# EAGLE schematic Linefollower_STM32 (EAGLE 9.6.2)
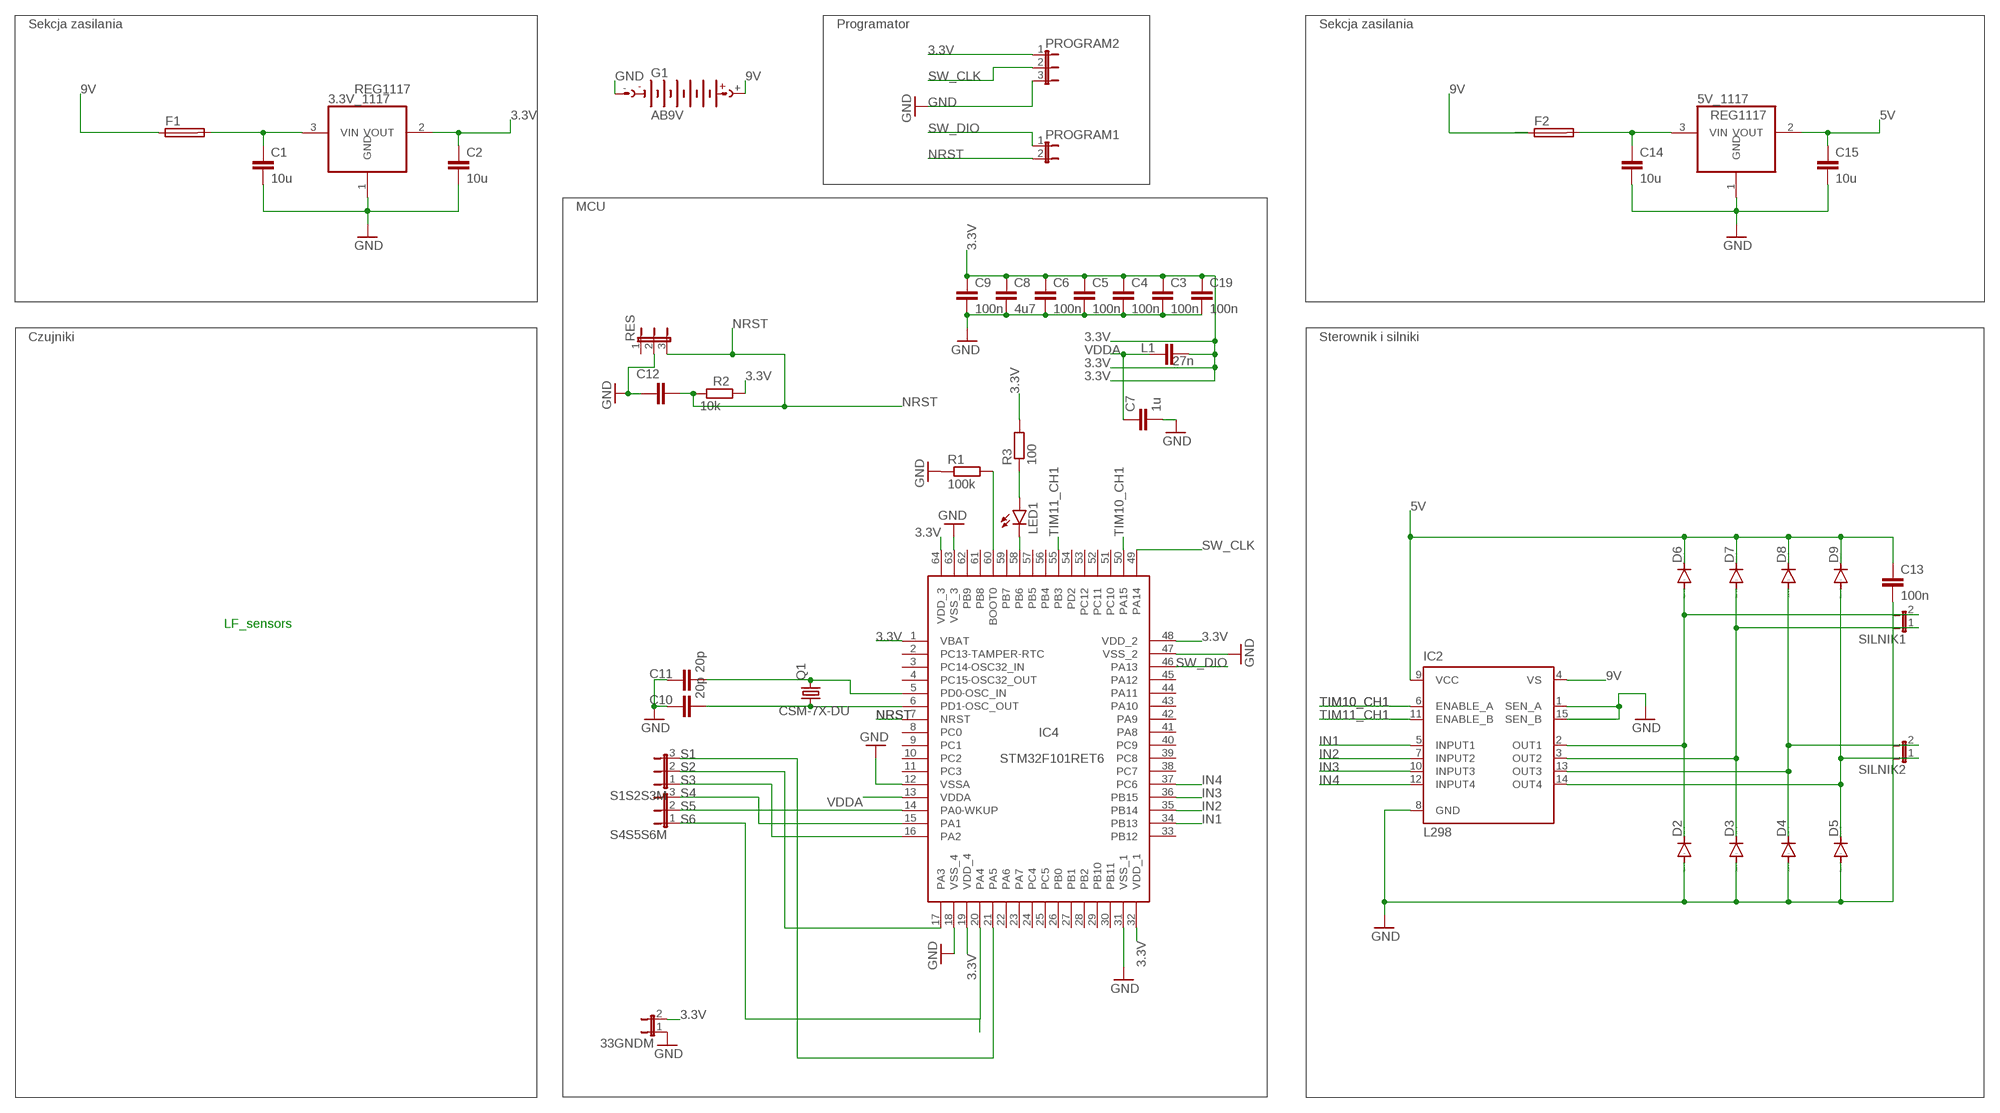
[diagram p0: schematic, sheet 1]

## Parts
3.3V_1117  REG1117  [SOT223]
5V_1117  REG1117  [SOT223]
33GNDM  JP1E  [JP1]
C1  10u  C-EUC0805  [C0805]
C2  10u  C-EUC0805  [C0805]
C3  100n  C-EUC0805  [C0805]
C4  100n  C-EUC0805  [C0805]
C5  100n  C-EUC0805  [C0805]
C6  100n  C-EUC0805  [C0805]
C7  1u  C-EUC0805  [C0805]
C8  4u7  C-EUC0805  [C0805]
C9  100n  C-EUC0805  [C0805]
C10  20p  C-EUC0805  [C0805]
C11  20p  C-EUC0805  [C0805]
C12  C-EUC0805  [C0805]
C13  100n  C-EUC0805  [C0805]
C14  10u  C-EUC0805  [C0805]
C15  10u  C-EUC0805  [C0805]
C19  100n  C-EUC0805  [C0805]
D2  DIODE-DO214AA  [DO214AA]
D3  DIODE-DO214AA  [DO214AA]
D4  DIODE-DO214AA  [DO214AA]
D5  DIODE-DO214AA  [DO214AA]
D6  DIODE-DO214AA  [DO214AA]
D7  DIODE-DO214AA  [DO214AA]
D8  DIODE-DO214AA  [DO214AA]
D9  DIODE-DO214AA  [DO214AA]
F1  TE5  [TE5]
F2  TE5  [TE5]
G1  AB9V  [AB9V]
IC2  L298  [MULTIWATT-15]
IC4  STM32F101RET6  [QFP50P1200X1200X160-64N]
L1  27n  C-EUC0805  [C0805]
LED1  LEDSML1206  [SML1206]
PROGRAM1  JP1E  [JP1]
PROGRAM2  JP2E  [JP2]
Q1  CSM-7X-DU  [CSM-7X-DU]
R1  100k  R-EU_R0805  [R0805]
R2  10k  R-EU_R0805  [R0805]
R3  100  R-EU_R0805  [R0805]
RES  JP2E  [JP2]
S1S2S3M  JP2E  [JP2]
S4S5S6M  JP2E  [JP2]
SILNIK1  JP1E  [JP1]
SILNIK2  JP1E  [JP1]

## Nets
3.3V: 3.3V_1117.2(VOUT) 33GNDM.2 C2.1 C3.1 C4.1 C5.1 C6.1 C8.1 C9.1 C19.1 IC4.1(VBAT) IC4.19(VDD_4) IC4.32(VDD_1) IC4.48(VDD_2) IC4.64(VDD_3) L1.2 PROGRAM2.1 R2.2 R3.2
5V: 5V_1117.2(VOUT) C13.1 C15.1 D6.C D7.C D8.C D9.C IC2.9(VCC)
9V: F1.1 F2.1 G1.+ IC2.4(VS)
GND: 3.3V_1117.1(GND) 5V_1117.1(GND) 33GNDM.1 C1.2 C2.2 C3.2 C4.2 C5.2 C6.2 C7.2 C8.2 C9.2 C10.1 C11.1 C12.1 C13.2 C14.2 C15.2 C19.2 D2.A D3.A D4.A D5.A G1.- IC2.1(SEN_A) IC2.8(GND) IC2.15(SEN_B) IC4.12(VSSA) IC4.18(VSS_4) IC4.31(VSS_1) IC4.47(VSS_2) IC4.63(VSS_3) PROGRAM2.3 R1.1 RES.2
IN1: IC2.5(INPUT1) IC4.34(PB13)
IN2: IC2.7(INPUT2) IC4.35(PB14)
IN3: IC2.10(INPUT3) IC4.36(PB15)
IN4: IC2.12(INPUT4) IC4.37(PC6)
N$1: C10.2 IC4.6(PD1-OSC_OUT) Q1.1
N$3: 3.3V_1117.3(VIN) C1.1 F1.2
N$4: C11.2 IC4.5(PD0-OSC_IN) Q1.2
N$5: IC4.60(BOOT0) R1.2
N$6: IC4.58(PB6) LED1.C
N$7: LED1.A R3.1
N$17: D2.C D6.A IC2.2(OUT1) SILNIK1.2
N$18: D3.C D7.A IC2.3(OUT2) SILNIK1.1
N$19: D4.C D8.A IC2.13(OUT3) SILNIK2.2
N$20: D5.C D9.A IC2.14(OUT4) SILNIK2.1
N$25: 5V_1117.3(VIN) C14.1 F2.2
NRST: C12.2 IC4.7(NRST) PROGRAM1.2 R2.1 RES.3
S1: IC4.21(PA5) S1S2S3M.3
S2: IC4.17(PA3) S1S2S3M.2
S3: IC4.16(PA2) S1S2S3M.1
S4: IC4.15(PA1) S4S5S6M.3
S5: IC4.14(PA0-WKUP) S4S5S6M.2
S6: IC4.20(PA4) S4S5S6M.1
SW_CLK: IC4.49(PA14) PROGRAM2.2
SW_DIO: IC4.46(PA13) PROGRAM1.1
TIM10_CH1: IC2.6(ENABLE_A) IC4.50(PA15)
TIM11_CH1: IC2.11(ENABLE_B) IC4.55(PB3)
VDDA: C7.1 IC4.13(VDDA) L1.1
Unconnected: IC4.2(PC13-TAMPER-RTC) IC4.3(PC14-OSC32_IN) IC4.4(PC15-OSC32_OUT) IC4.8(PC0) IC4.9(PC1) IC4.10(PC2) IC4.11(PC3) IC4.22(PA6) IC4.23(PA7) IC4.24(PC4) IC4.25(PC5) IC4.26(PB0) IC4.27(PB1) IC4.28(PB2) IC4.29(PB10) IC4.30(PB11) IC4.33(PB12) IC4.38(PC7) IC4.39(PC8) IC4.40(PC9) IC4.41(PA8) IC4.42(PA9) IC4.43(PA10) IC4.44(PA11) IC4.45(PA12) IC4.51(PC10) IC4.52(PC11) IC4.53(PC12) IC4.54(PD2) IC4.56(PB4) IC4.57(PB5) IC4.59(PB7) IC4.61(PB8) IC4.62(PB9) RES.1

## Notes on the sheet
- Sekcja zasilania | Programator | Sekcja zasilania
- MCU
- Czujniki | Sterownik i silniki
- LF_sensors

## Library data of the parts
3.3V_1117 5V_1117 = burr-brown:REG1117: 800mA and 1A Low Dropout (LDO) Positive Regulator 1.8V, 2.5V, 2.85V, 3.3V, 5V, and Adj; MPN: REG1117; OC_FARNELL: 1097566; OC_NEWARK: 14P6981
33GNDM PROGRAM1 SILNIK1 SILNIK2 = jumper:JP1E: JUMPER
C1-C15 C19 L1 = rcl:C-EU: CAPACITOR, European symbol; SPICEPREFIX: C
D2-D9 = diode:DIODE-: DIODE
F1 F2 = fuse:TE5: FUSE Wickmann; OC_FARNELL: unknown; OC_NEWARK: unknown
G1 = battery:AB9V: 9-V BATTERY CLIP
IC2 = st-microelectronics:L298: DUAL FULL-BRIDGE DRIVER; MPN: L298N; OC_FARNELL: 1589425; OC_NEWARK: 32M1527
IC4 = STM32F101RET6:STM32F101RET6: STM32F101RET6, 32 bit ARM Cortex M3 Microcontroller 36MHz 512kb Flash, 48kb RAM, I2C SPI 64-Pin LQFP Source: Datasheet <http://www.st.com/st-web-ui/static/active/en/resource/technical/document/datasheet/CD00191174.pdf>; ARROW_PART_NUMBER: STM32F101RET6; ARROW_PRICE-STOCK: https://www.arrow.com/en/products/stm32f101ret6/stmicroelectronics; DESCRIPTION: STM32F101RET6, 32 bit ARM Cortex M3 Microcontroller 36MHz 512kb Flash, 48kb RAM, I2C SPI 64-Pin LQFP; HEIGHT: 1.6mm; MANUFACTURER_NAME: STMicroelectronics; MANUFACTURER_PART_NUMBER: STM32F101RET6; MOUSER_PART_NUMBER: 511-STM32F101RET6; MOUSER_PRICE-STOCK: https://www.mouser.co.uk/ProductDetail/STMicroelectronics/STM32F101RET6?qs=tZXS5FmuAdk0z%2Fo1gi8heg%3D%3D
LED1 = led:LED: LED OSRAM: - CHIPLED LG R971, LG N971, LY N971, LG Q971, LY Q971, LO R971, LY R971 LH N974, LH R974 LS Q976, LO Q976, LY Q976 LO Q996 - Hyper CHIPLED LW Q18S LB Q993, LB Q99A, LB R99A - SideLED LS A670, LO A670, LY A670, LG A670, LP A670 LB A673, LV A673, LT A673, LW A673 LH A674 LY A675 LS A676, LA A676, LO A676, LY A676, LW A676 LS A679, LY A679, LG A679 - Hyper Micro SIDELED® LS Y876, LA Y876, LO Y876, LY Y876 LT Y87S - SmartLED LW L88C, LW L88S LB L89C, LB L89S, LG L890 LS L89K, LO L89K, LY L89K LS L896, LA L896, LO L896, LY L896 - TOPLED LS T670, LO T670, LY T670, LG T670, LP T670 LSG T670, LSP T670, LSY T670, LOP T670, LYG T670 LG T671, LOG T671, LSG T671 LB T673, LV T673, LT T673, LW T673 LH T674 LS T676, LA T676, LO T676, LY T676, LB T676, LH T676, LSB T676, LW T676 LB T67C, LV T67C, LT T67C, LS T67K, LO T67K, LY T67K, LW E67C LS E67B, LA E67B, LO E67B, LY E67B, LB E67C, LV E67C, LT E67C LW T67C LS T679, LY T679, LG T679 LS T770, LO T770, LY T770, LG T770, LP T770 LB T773, LV T773, LT T773, LW T773 LH T774 LS E675, LA E675, LY E675, LS T675 LS T776, LA T776, LO T776, LY T776, LB T776 LHGB T686 LT T68C, LB T68C - Hyper Mini TOPLED® LB M676 - Mini TOPLED Santana® LG M470 LS M47K, LO M47K, LY M47K Source: http://www.osram.convergy.de LUXEON: - LUMILED® LXK2-PW12-R00, LXK2-PW12-S00, LXK2-PW14-U00, LXK2-PW14-V00 LXK2-PM12-R00, LXK2-PM12-S00, LXK2-PM14-U00 LXK2-PE12-Q00, LXK2-PE12-R00, LXK2-PE12-S00, LXK2-PE14-T00, LXK2-PE14-U00 LXK2-PB12-K00, LXK2-PB12-L00, LXK2-PB12-M00, LXK2-PB14-N00, LXK2-PB14-P00, LXK2-PB14-Q00 LXK2-PR12-L00, LXK2-PR12-M00, LXK2-PR14-Q00, LXK2-PR14-R00 LXK2-PD12-Q00, LXK2-PD12-R00, LXK2-PD12-S00 LXK2-PH12-R00, LXK2-PH12-S00 LXK2-PL12-P00, LXK2-PL12-Q00, LXK2-PL12-R00 Source: www.luxeon.com KINGBRIGHT: KA-3528ASYC Source: www.kingbright.com
PROGRAM2 RES S1S2S3M S4S5S6M = jumper:JP2E: JUMPER
Q1 = crystal:CSM-7X-DU: SMD CRYSTAL Source: www.ecsxtal.com .. Crystal 3.6864MHz CSM_7X_DU.PDF; OC_FARNELL: unknown; OC_NEWARK: unknown
R1-R3 = rcl:R-EU_: RESISTOR, European symbol; SPICEPREFIX: R